# Altium schematic sheet System Control - Mode DIP Switch.SchDoc
size B
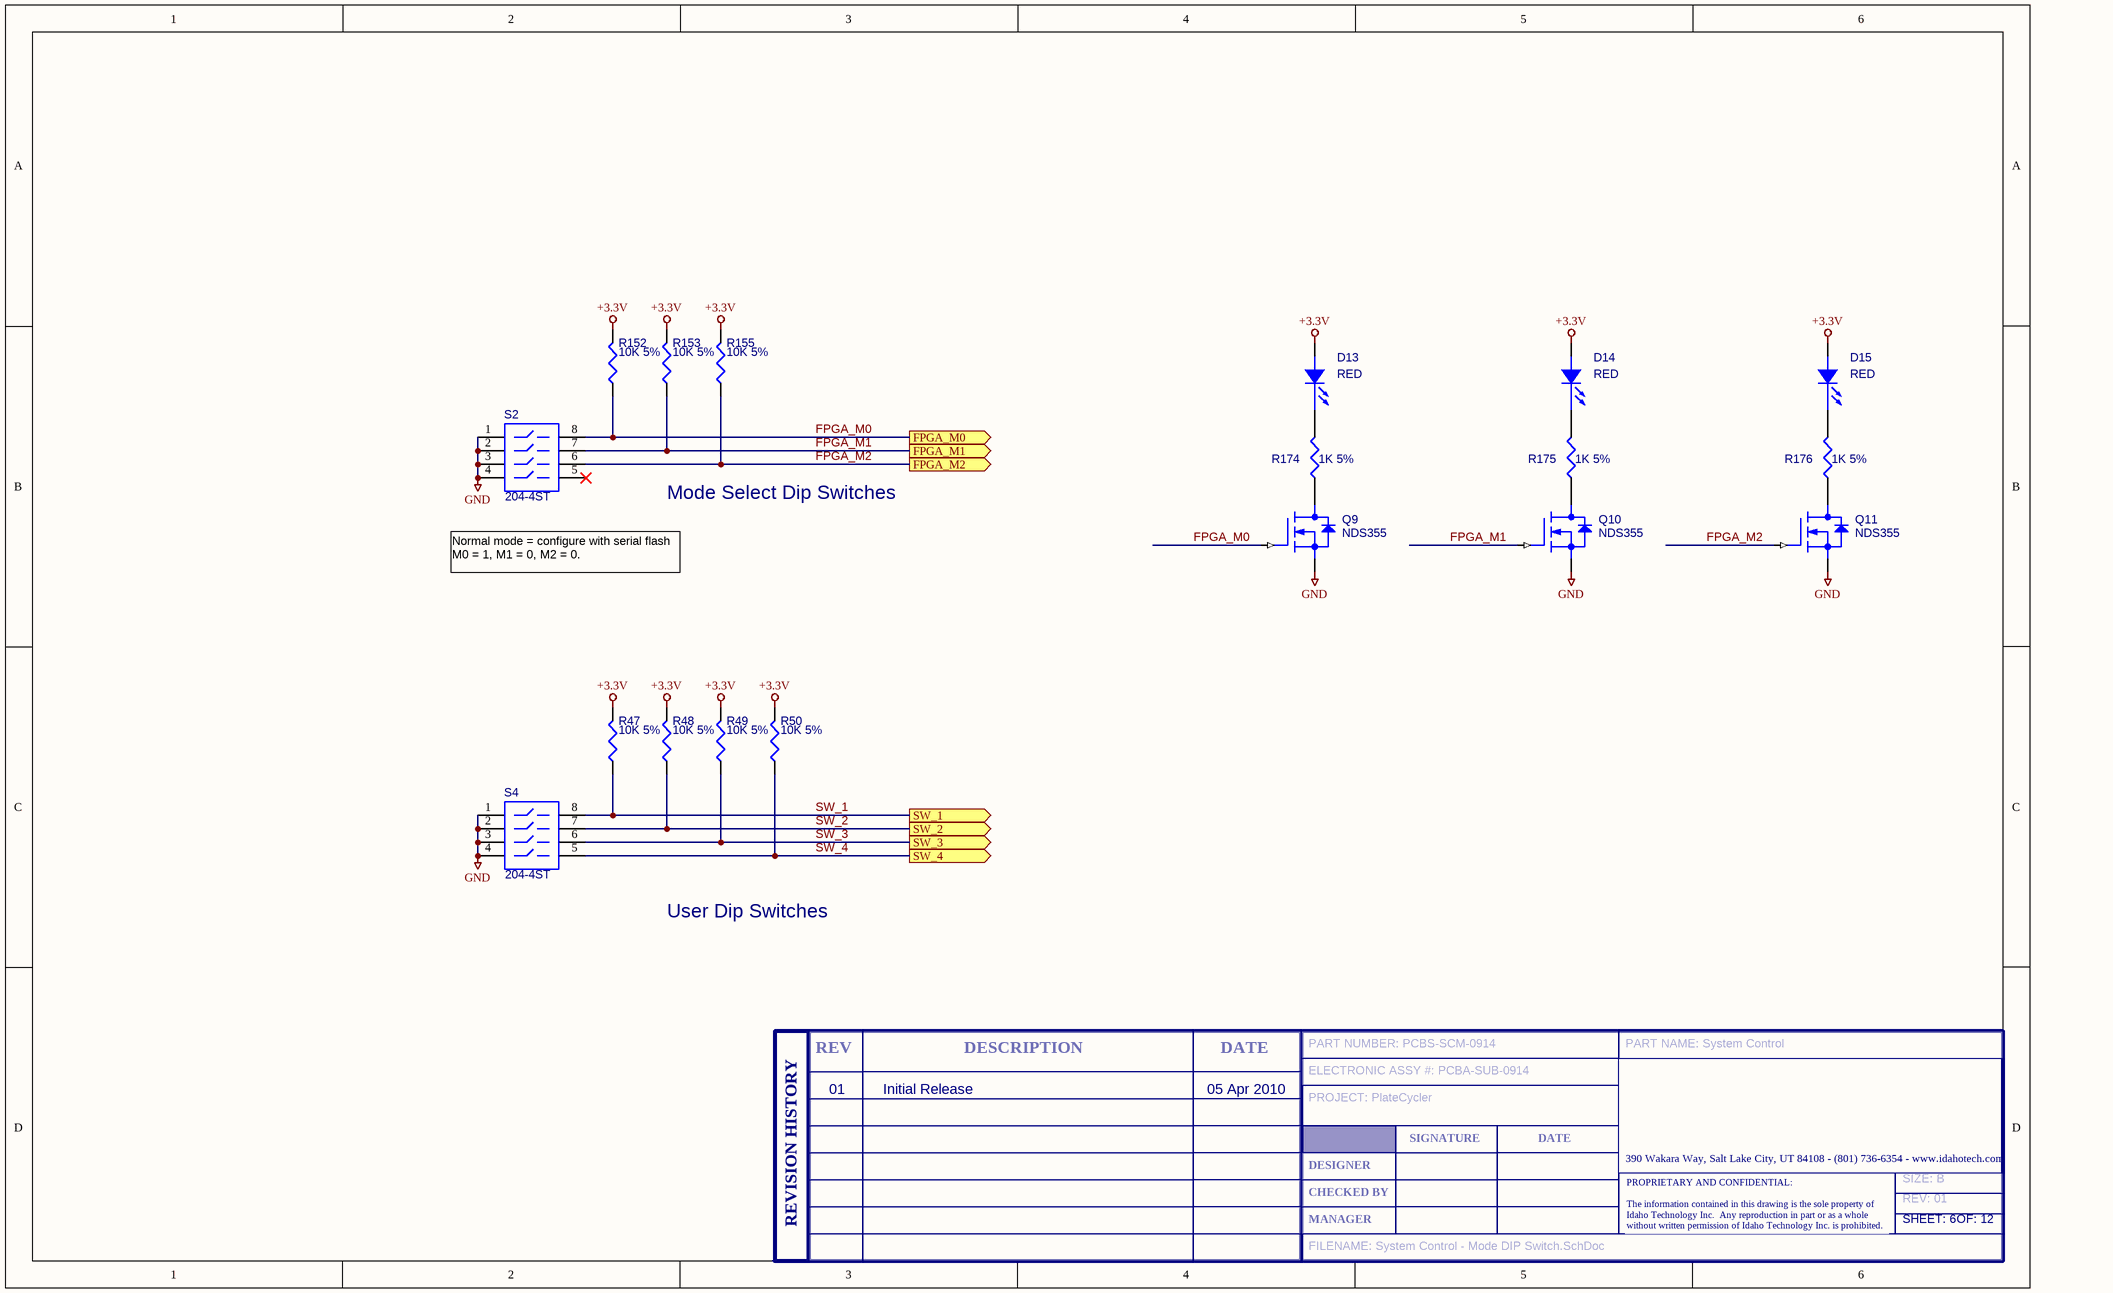
[diagram p0: System Control - Mode DIP Switch.SchDoc]

## Parts
D13  RED  [LED 1206]
D14  RED  [LED 1206]
D15  RED  [LED 1206]
Q9  NDS355  [TO236AA/SOT23]
Q10  NDS355  [TO236AA/SOT23]
Q11  NDS355  [TO236AA/SOT23]
R47  10K 5%  [SM/R_0603]
R48  10K 5%  [SM/R_0603]
R49  10K 5%  [SM/R_0603]
R50  10K 5%  [SM/R_0603]
R152  10K 5%  [SM/R_0603]
R153  10K 5%  [SM/R_0603]
R155  10K 5%  [SM/R_0603]
R174  1K 5%  [SM/R_0603]
R175  1K 5%  [SM/R_0603]
R176  1K 5%  [SM/R_0603]
S2  Manufacturer P/N: 204-4ST  [SPST_SMT8]  (hidden comment: SW-DIP4)
S4  Manufacturer P/N: 204-4ST  [SPST_SMT8]  (hidden comment: SW-DIP4)
T?  SIZE: B  REV: 01  FILENAME: System Control - Mode DIP Switch.SchDoc  PART NUMBER: PCBS-SCM-0914  PART NAME: System Control  ELECTRONIC ASSY #: PCBA-SUB-0914  PROJECT: PlateCycler  SHEET: 6  OF: 12  (hidden comment: ITI Title Block, A Size)  (graphical)

## Ports
FPGA_M0 (out), FPGA_M1 (out), FPGA_M2 (out), SW_1 (out), SW_2 (out), SW_3 (out), SW_4 (out)

## Nets
+3.3V: D13.1(ANODE) D14.1(ANODE) D15.1(ANODE) R47.2 R48.2 R49.2 R50.2 R152.2 R153.2 R155.2
GND: Q9.2(SOURCE) Q10.2(SOURCE) Q11.2(SOURCE) S2.1 S2.2 S2.3 S2.4 S4.1 S4.2 S4.3 S4.4
FPGA_M0: Q9.1(GATE) R152.1 S2.8 ; port FPGA_M0
FPGA_M1: Q10.1(GATE) R153.1 S2.7 ; port FPGA_M1
FPGA_M2: Q11.1(GATE) R155.1 S2.6 ; port FPGA_M2
SW_1: R47.1 S4.8 ; port SW_1
SW_2: R48.1 S4.7 ; port SW_2
SW_3: R49.1 S4.6 ; port SW_3
SW_4: R50.1 S4.5 ; port SW_4
NetD13_2: D13.2(CATHODE) R174.2
NetD14_2: D14.2(CATHODE) R175.2
NetD15_2: D15.2(CATHODE) R176.2
NetQ9_3: Q9.3(DRAIN) R174.1
NetQ10_3: Q10.3(DRAIN) R175.1
NetQ11_3: Q11.3(DRAIN) R176.1

Not connected (* = marked no-connect by the designer): S2 5*

## Notes on the sheet
- Mode Select Dip Switches
- Normal mode = configure with serial flash
  M0 = 1, M1 = 0, M2 = 0.
- User Dip Switches
- 01
- Initial Release
- 05 Apr 2010
- (in symbol ITI A-size Title Block and Rev Table) REV; DESCRIPTION; DATE; SIGNATURE; 390 Wakara Way, Salt Lake City, UT 84108 - (801) 736-6354 - www.idahotech.com; DESIGNER; CHECKED BY; REVISION HISTORY; MANAGER; PROPRIETARY AND CONFIDENTIAL: / The information contained in this drawing is the sole property of / Idaho Technology Inc.  Any reproduction in part or as a whole / without written permission of Idaho Technology Inc. is prohibited.

## Library data of the parts
D13-D15 = LED: LED 635NM RED WTR CLR 1206 SMD; Manufacturer: Lumex; Manufacturer P/N: SML-LX1206IC-TR; Vendor: Digikey; Vendor P/N: 67-1356-1-ND
Q9-Q11 = NDS355N/SOT: MOSFET N-CH 30V 1.6A SOT-23; Manufacturer: Fairchild Semiconductor; Vendor: Digikey; Vendor P/N: NDS355NCT-ND; Manufacturer P/N: NDS355N
R47-R50 R152 R153 R155 = R10K 5% 0603: RES 10K OHM 1/10W 5% 0603 SMD; Manufacturer: Panasonic; Manufacturer P/N: ERJ-3GEYJ103V; Vendor: Digikey; Vendor P/N: P10KGCT-ND
R174-R176 = R1K 5% 0603: RES 1.0K OHM 1/10W 5% 0603 SMD; Manufacturer: Panasonic; Manufacturer P/N: ERJ-3GEYJ102V; Vendor: Digikey; Vendor P/N: P1.0KGCT-ND
S2 S4 = SW-DIP4: SWITCH DIP 4POS TOP SLIDE SMT; Manufacturer: CTS Corporation Electro Components; Vendor: Digikey; Vendor P/N: CT2044ST-ND; Published: 24-Mar-1999; LatestRevisionDate: 17-Jul-2002; LatestRevisionNote: Re-released for DXP Platform.; PackageReference: DIP-8; Publisher: Altium Limited
T? = ITI A-size Title Block and Rev Table: ITI Title Block and Rev Table, A Size